# EAGLE design untitled (EAGLE 5.11)
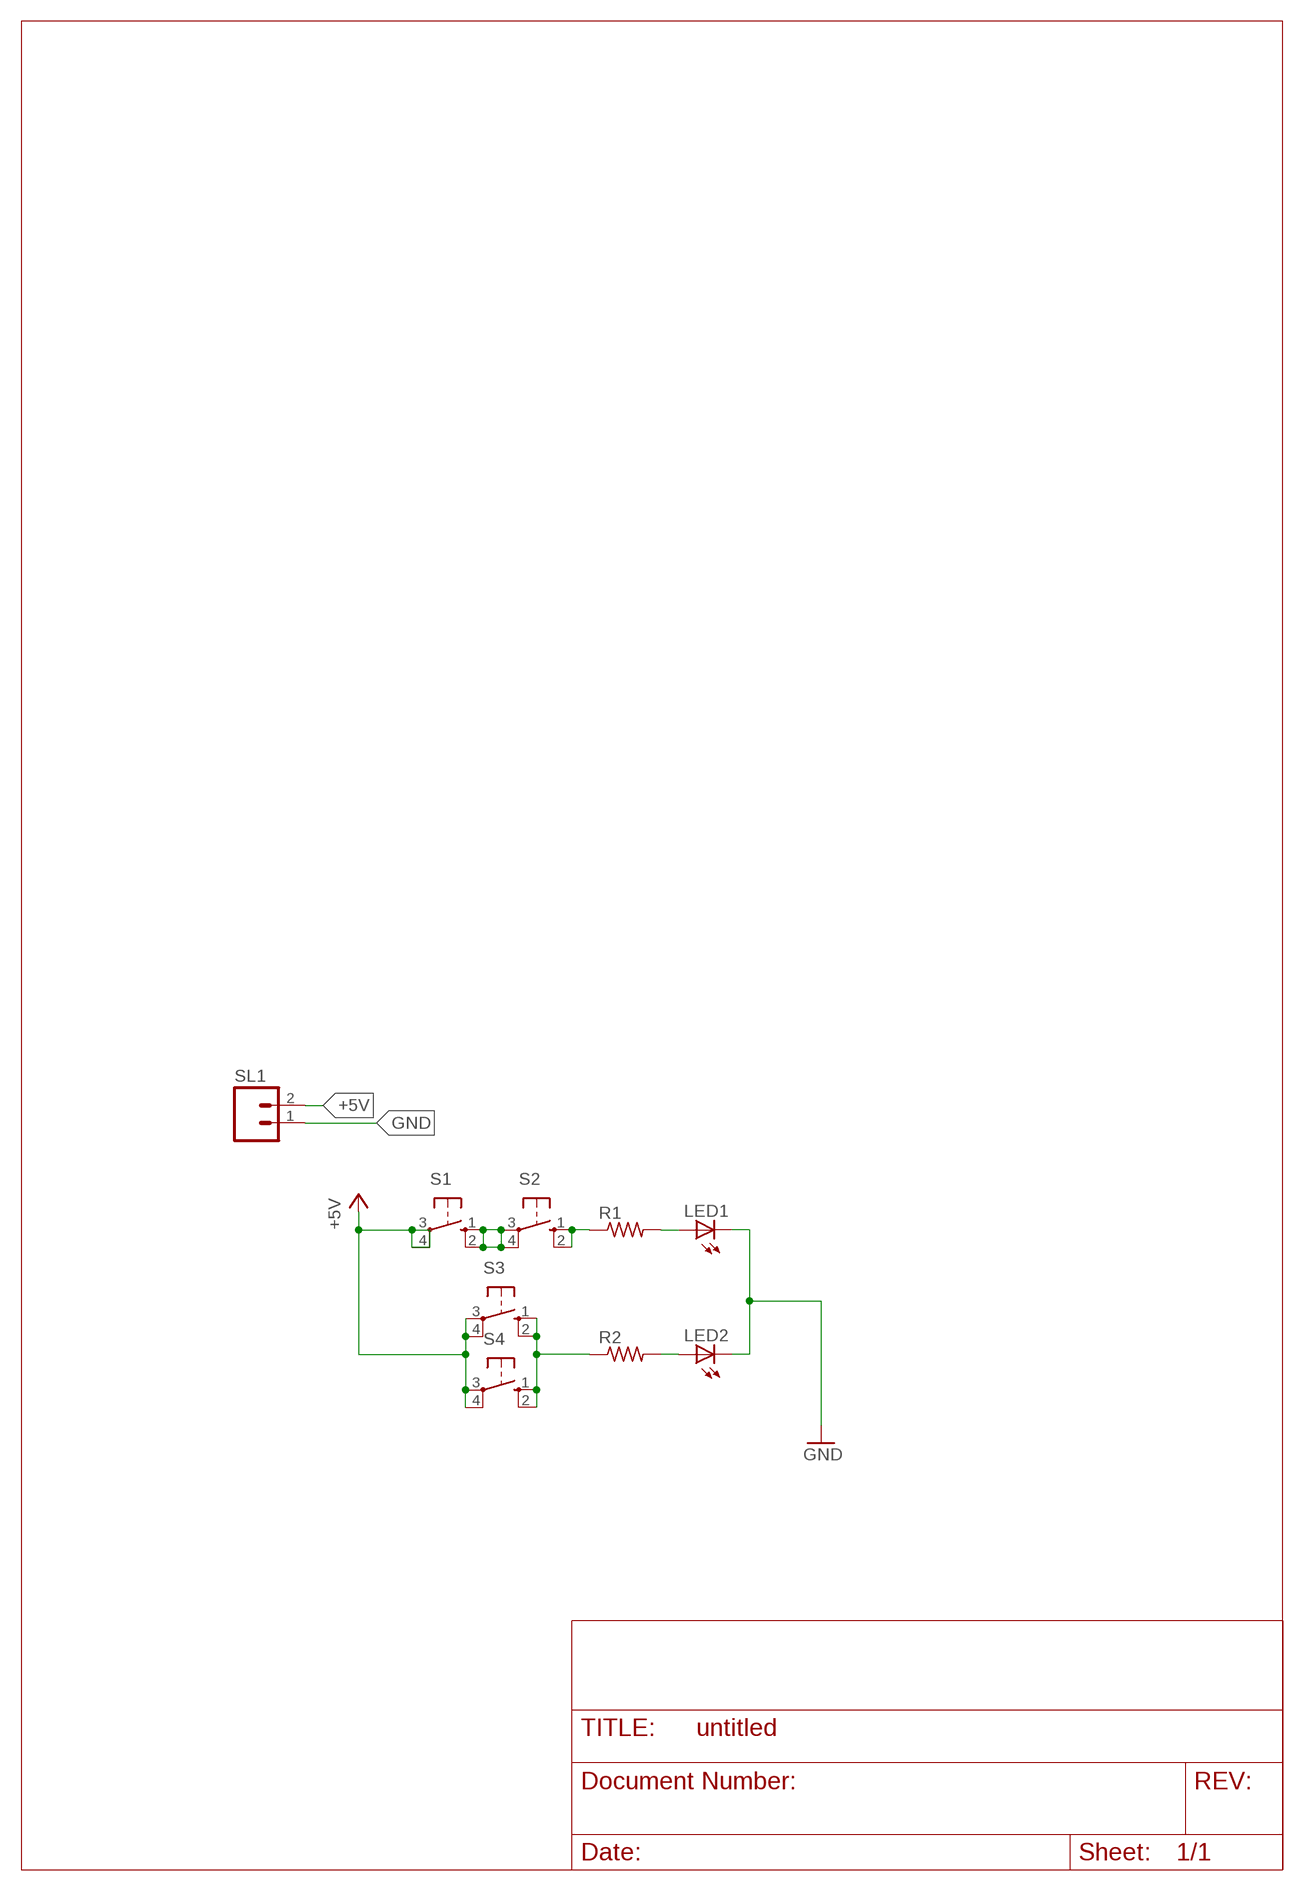
[diagram p0: schematic, sheet 1]

## Parts
LED1  LED3MM  [LED3MM]
LED2  LED3MM  [LED3MM]
R1  R-US_0207/10  [0207/10]
R2  R-US_0207/10  [0207/10]
S1  10-XX  [B3F-10XX]
S2  10-XX  [B3F-10XX]
S3  10-XX  [B3F-10XX]
S4  10-XX  [B3F-10XX]
SL1  M02  [02P]

## Nets
+5V: S1.3(P) S3.3(P) S3.4(P1) S4.3(P) S4.4(P1) SL1.2
GND: LED1.K(C) LED2.K(C) SL1.1
N$1: LED1.A R1.2
N$2: S1.1(S) S1.2(S1) S2.3(P) S2.4(P1)
N$4: R1.1 S2.1(S) S2.2(S1)
N$7: R2.1 S3.1(S) S3.2(S1) S4.1(S) S4.2(S1)
N$8: LED2.A R2.2
Unconnected: S1.4(P1)

## Library data of the parts
LED1 LED2 = led:LED: LED OSRAM: - CHIPLED LG R971, LG N971, LY N971, LG Q971, LY Q971, LO R971, LY R971 LH N974, LH R974 LS Q976, LO Q976, LY Q976 LO Q996 - Hyper CHIPLED LW Q18S LB Q993, LB Q99A, LB R99A - SideLED LS A670, LO A670, LY A670, LG A670, LP A670 LB A673, LV A673, LT A673, LW A673 LH A674 LY A675 LS A676, LA A676, LO A676, LY A676, LW A676 LS A679, LY A679, LG A679 - Hyper Micro SIDELED® LS Y876, LA Y876, LO Y876, LY Y876 LT Y87S - SmartLED LW L88C, LW L88S LB L89C, LB L89S, LG L890 LS L89K, LO L89K, LY L89K LS L896, LA L896, LO L896, LY L896 - TOPLED LS T670, LO T670, LY T670, LG T670, LP T670 LSG T670, LSP T670, LSY T670, LOP T670, LYG T670 LG T671, LOG T671, LSG T671 LB T673, LV T673, LT T673, LW T673 LH T674 LS T676, LA T676, LO T676, LY T676, LB T676, LH T676, LSB T676, LW T676 LB T67C, LV T67C, LT T67C, LS T67K, LO T67K, LY T67K, LW E67C LS E67B, LA E67B, LO E67B, LY E67B, LB E67C, LV E67C, LT E67C LW T67C LS T679, LY T679, LG T679 LS T770, LO T770, LY T770, LG T770, LP T770 LB T773, LV T773, LT T773, LW T773 LH T774 LS E675, LA E675, LY E675, LS T675 LS T776, LA T776, LO T776, LY T776, LB T776 LHGB T686 LT T68C, LB T68C - Hyper Mini TOPLED® LB M676 - Mini TOPLED Santana® LG M470 LS M47K, LO M47K, LY M47K Source: http://www.osram.convergy.de LUXEON: - LUMILED® LXK2-PW12-R00, LXK2-PW12-S00, LXK2-PW14-U00, LXK2-PW14-V00 LXK2-PM12-R00, LXK2-PM12-S00, LXK2-PM14-U00 LXK2-PE12-Q00, LXK2-PE12-R00, LXK2-PE12-S00, LXK2-PE14-T00, LXK2-PE14-U00 LXK2-PB12-K00, LXK2-PB12-L00, LXK2-PB12-M00, LXK2-PB14-N00, LXK2-PB14-P00, LXK2-PB14-Q00 LXK2-PR12-L00, LXK2-PR12-M00, LXK2-PR14-Q00, LXK2-PR14-R00 LXK2-PD12-Q00, LXK2-PD12-R00, LXK2-PD12-S00 LXK2-PH12-R00, LXK2-PH12-S00 LXK2-PL12-P00, LXK2-PL12-Q00, LXK2-PL12-R00 Source: www.luxeon.com KINGBRIGHT: KA-3528ASYC Source: www.kingbright.com
R1 R2 = rcl:R-US_: RESISTOR, American symbol
S1-S4 = switch-omron:10-XX: OMRON SWITCH; MPN: B3F-1000; OC_FARNELL: 176432; OC_NEWARK: 36M3542
SL1 = con-amp-quick:M02: AMP QUICK CONNECTOR; OC_FARNELL: unknown; OC_NEWARK: unknown

## Board
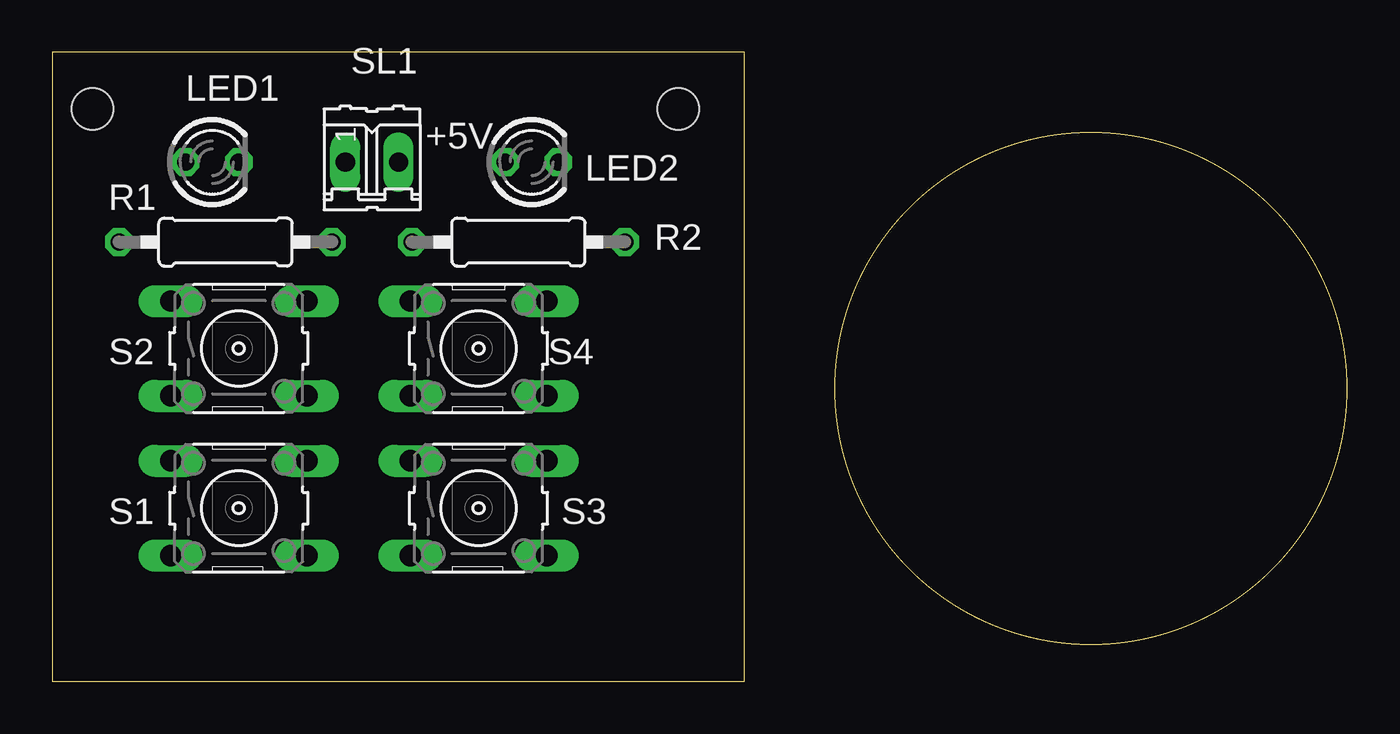
[diagram p1: board, top side]
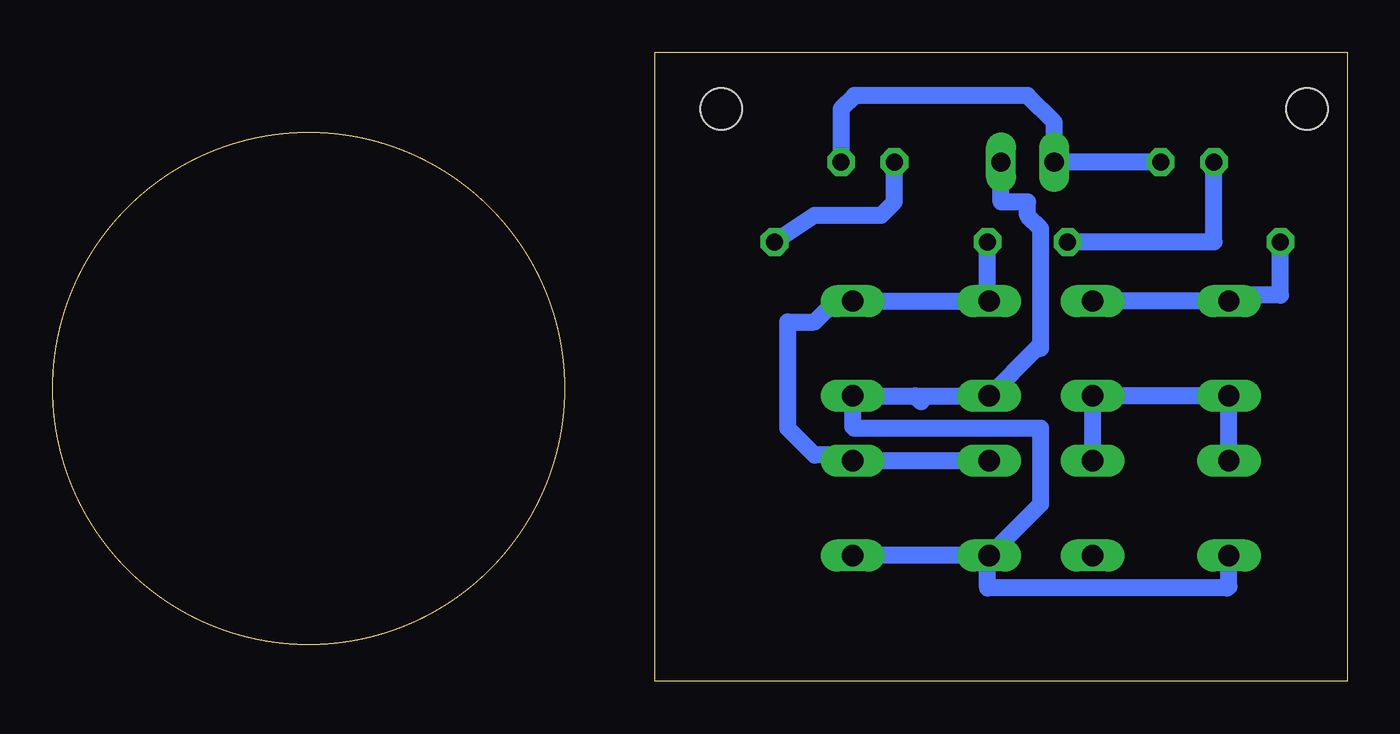
[diagram p2: board, bottom side, seen from below]

Size 61.74 x 30 mm. Coordinates in mm from the lower left corner, seen from the top.
Outline: 0,0 33,0 33,30 0,30 0,0
Outline: circle at 49.53,13.97 radius 12.21
Copper layers (1*16): Top 0.035mm / dielectric 1.5mm / Bottom 0.035mm
Design rules "default": minimum track width 10mil, minimum drill 24mil, track to track 8mil, track to pad 8mil, pad to pad 8mil, via to via 8mil, smd to smd 8mil, copper to edge 40mil, drill to drill 8mil, minimum pad ring 10mil, minimum via ring 8mil, stop-mask expansion 4mil, vias tented up to drill 0mil, thermal gap 10mil
Holes 1.98 mm at 1.91,27.3 29.84,27.3

### Footprints (pad centres in the part's own frame; a part is rotated, then mirrored left to right if it is on the bottom)
LED3MM = drill 0.813 octagon: A -1.27,0; K 1.27,0
0207/10 = drill 0.813 octagon: 1 -5.08,0; 2 5.08,0
B3F-10XX = drill 1.016 long: 1 -3.251,2.261; 2 3.251,2.261; 3 -3.251,-2.261; 4 3.251,-2.261
02P = drill 0.914 long: 1 -1.27,0; 2 1.27,0

### Placement (x,y rotation side)
LED1  7.62,24.77 0 top
LED2  22.86,24.77 0 top
R1  8.26,20.95 0 top
R2  22.23,20.95 0 top
S1  8.89,8.26 0 top
S2  8.89,15.88 0 top
S3  20.32,8.26 0 top
S4  20.32,15.88 0 top
SL1  15.24,24.77 0 top

### Tracks (layer width: path | path; a pad name or v marks a point on that pad's centre or on a via)
+5V
  Bottom 0.813: S4.4 20.6,13.61 20.32,13.34 | S4.4 S4.3 14.81,15.88 14.61,15.88 14.61,21.59 15.24,22.23 15.24,22.86 16.51,22.86 SL1.2 | S1.3 5.64,4.52 5.71,4.45 17.14,4.45 17.14,5.92 S3.3 | S3.3 S3.4 | S4.4 23.57,12.14 23.5,12.06 14.61,12.06 14.61,8.46 S3.3
GND
  Bottom 0.813: LED1.K SL1.1 13.97,26.67 15.24,27.94 23.5,27.94 24.13,27.3 LED2.K
N$1
  Bottom 0.813: LED1.A 6.35,20.95 R1.2
N$2
  Bottom 0.813: S1.1 S2.3 S2.4 S1.2
N$4
  Bottom 0.813: S2.2 S2.1 5.36,18.41 3.17,18.41 R1.1
N$7
  Bottom 0.813: S3.1 S3.2 23.85,10.79 25.4,10.79 26.67,12.06 26.67,17.14 25.4,17.14 24.41,18.14 S4.2 S4.1 17.14,18.21 R2.1
N$8
  Bottom 0.813: LED2.A 21.59,22.86 22.23,22.23 25.4,22.23 R2.2

### Text on the board
tNames: +5V
tTest: Projeto MrAppleBR